# Altium project cs301_11.PrjPCB
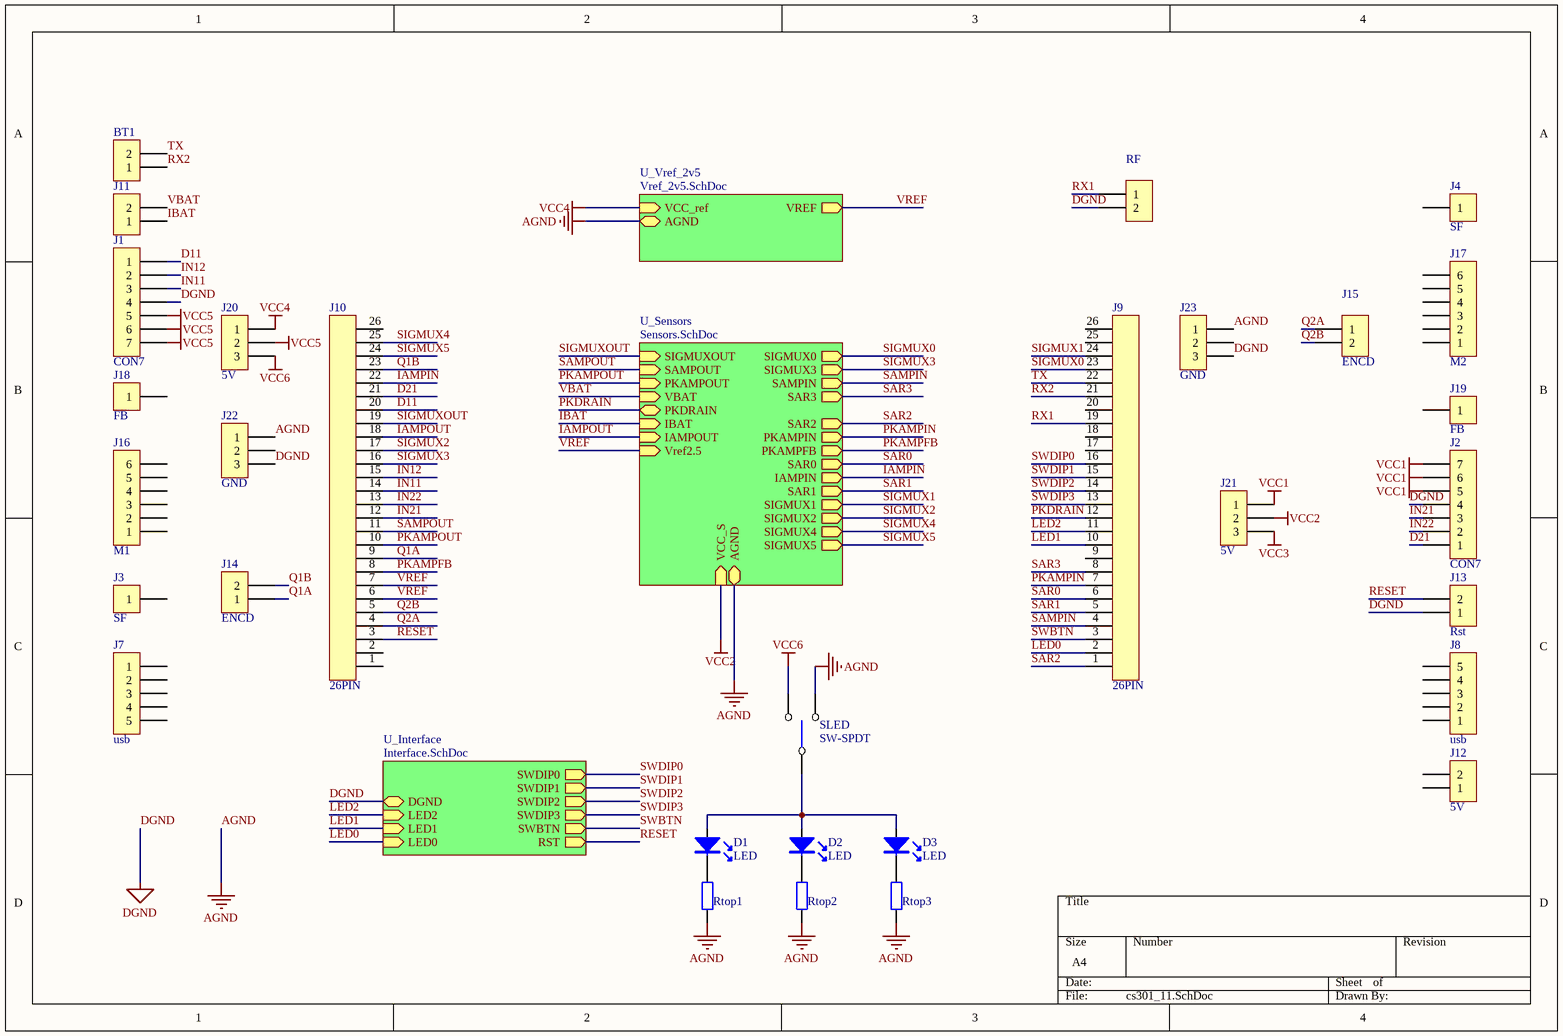
[diagram p0: cs301_11.SchDoc]
6 sheets, 112 parts. Net scope: hierarchical (ports join the sheet entries above them; power ports are global).
Board file: cs301_11.PcbDoc
Sheets:
  cs301_11.SchDoc
    U_Sensors = Sensors.SchDoc
      U_PT_Sensor1 = PT_Sensor.SchDoc
      U_PT_Sensor2 = PT_Sensor.SchDoc
      U_PT_Sensor3 = PT_Sensor.SchDoc
      U_PT_Sensor4 = PT_Sensor.SchDoc
      U_PT_Sensor5 = PT_Sensor.SchDoc
      U_PT_Sensor6 = PT_Sensor.SchDoc
      U_PT_Buffer1 = PT_Buffer.SchDoc
      U_PT_Buffer2 = PT_Buffer.SchDoc
      U_PT_Buffer3 = PT_Buffer.SchDoc
    U_Vref_2v5 = Vref_2v5.SchDoc
    U_Interface = Interface.SchDoc

## Sheet cs301_11.SchDoc
size A4

### Parts
BT1  Battery  [sip2]  (value not drawn)
D1  LED  [LED0.1/5MM]
D2  LED  [LED0.1/5MM]
D3  LED  [LED0.1/5MM]
J1  CON7  [SIP7]
J2  CON7  [SIP7]
J3  SF  [SIP1/0.6]
J4  SF  [SIP1/0.6]
J7  usb  [SIP5]
J8  usb  [SIP5]
J9  26PIN  [SIP26]
J10  26PIN  [SIP26]
J11  Battery  [sip2]  (value not drawn)
J12  5V  [sip2]
J13  Rst  [sip2]
J14  ENCD  [sip2]
J15  ENCD  [sip2]
J16  M1  [sip6]
J17  M2  [sip6]
J18  FB  [SIP1/0.6]
J19  FB  [SIP1/0.6]
J20  5V  [sip3]
J21  5V  [sip3]
J22  GND  [sip3]
J23  GND  [sip3]
RF  (no value)  [sip2]
Rtop1  270R  [ECE-RESC1608-0603SM]  (value not drawn)
Rtop2  270R  [ECE-RESC1608-0603SM]  (value not drawn)
Rtop3  270R  [ECE-RESC2012-0805SM]  (value not drawn)
SLED  SW-SPDT  [SW-SPDT]

### Sub-sheets
U_Interface = Interface.SchDoc: SWDIP0 (out), SWDIP1 (out), SWDIP2 (out), SWDIP3 (out), SWBTN (out), DGND (bidir), LED2 (in), LED1 (in), LED0 (in), RST (out)
U_Sensors = Sensors.SchDoc: SIGMUX0 (out), SIGMUX3 (out), SIGMUXOUT (in), SAMPIN (out), SAR3 (out), Vref2.5 (in), SAMPOUT (in), SAR2 (out), PKAMPIN (out), PKAMPOUT (in), PKAMPFB (out), VBAT (in), SAR0 (out), PKDRAIN (bidir), IBAT (in), IAMPIN (out), IAMPOUT (in), SAR1 (out), SIGMUX1 (out), SIGMUX2 (out), SIGMUX4 (out), SIGMUX5 (out), VCC_S (in), AGND (bidir)
U_Vref_2v5 = Vref_2v5.SchDoc: VREF (out), VCC_ref (in), AGND (bidir)

### Nets
AGND: J22.1 J23.1 Rtop1.1 Rtop2.1 Rtop3.1 SLED.3 ; sheet U_Sensors/AGND, sheet U_Vref_2v5/AGND
DGND: J1.4 J2.4 J13.1 J22.3 J23.3 RF.2 ; sheet U_Interface/DGND
VCC1: J2.5 J2.6 J2.7 J21.1
VCC2: J21.2 ; sheet U_Sensors/VCC_S
VCC3: J21.3
VCC4: J20.1 ; sheet U_Vref_2v5/VCC_ref
VCC5: J1.5 J1.6 J1.7 J20.2
VCC6: J20.3 SLED.1
D11: J1.1 J10.20
D21: J2.1 J10.21
IAMPIN: J10.22 J11.1 ; sheet U_Sensors/IBAT, sheet U_Sensors/IAMPIN  [also labelled IBAT]
IAMPOUT: J9.5 J10.18 ; sheet U_Sensors/IAMPOUT, sheet U_Sensors/SAR1  [also labelled SAR1]
IN11: J1.3 J10.14
IN12: J1.2 J10.15
IN21: J2.3 J10.12
IN22: J2.2 J10.13
LED0: J9.2 ; sheet U_Interface/LED0
LED1: J9.10 ; sheet U_Interface/LED1
LED2: J9.11 ; sheet U_Interface/LED2
PKAMPFB: J10.8 ; sheet U_Sensors/PKAMPFB
PKAMPIN: J9.1 J9.7 J10.11 ; sheet U_Sensors/SAMPOUT, sheet U_Sensors/SAR2, sheet U_Sensors/PKAMPIN  [also labelled SAMPOUT, SAR2]
PKAMPOUT: J10.10 ; sheet U_Sensors/PKAMPOUT
PKDRAIN: J9.12 ; sheet U_Sensors/PKDRAIN
Q1A: J10.9 J14.1
Q1B: J10.23 J14.2
Q2A: J10.4 J15.1
Q2B: J10.5 J15.2
RESET: J10.3 J13.2 ; sheet U_Interface/RST
RX1: J9.19 RF.1
RX2: BT1.1 J9.21
SAMPIN: J9.4 ; sheet U_Sensors/SAMPIN
SAR0: J9.6 ; sheet U_Sensors/SAR0
SAR3: J9.8 J10.19 ; sheet U_Sensors/SIGMUXOUT, sheet U_Sensors/SAR3  [also labelled SIGMUXOUT]
SIGMUX0: J9.23 ; sheet U_Sensors/SIGMUX0
SIGMUX1: J9.24 ; sheet U_Sensors/SIGMUX1
SIGMUX2: J10.17 ; sheet U_Sensors/SIGMUX2
SIGMUX3: J10.16 ; sheet U_Sensors/SIGMUX3
SIGMUX4: J10.25 ; sheet U_Sensors/SIGMUX4
SIGMUX5: J10.24 ; sheet U_Sensors/SIGMUX5
SWBTN: J9.3 ; sheet U_Interface/SWBTN
SWDIP0: J9.16 ; sheet U_Interface/SWDIP0
SWDIP1: J9.15 ; sheet U_Interface/SWDIP1
SWDIP2: J9.14 ; sheet U_Interface/SWDIP2
SWDIP3: J9.13 ; sheet U_Interface/SWDIP3
TX: BT1.2 J9.22
VBAT: J11.2 ; sheet U_Sensors/VBAT
VREF: J10.6 J10.7 ; sheet U_Sensors/Vref2.5, sheet U_Vref_2v5/VREF
NetD1_A: D1.A D2.A D3.A SLED.2
NetD1_K: D1.K Rtop1.2
NetD2_K: D2.K Rtop2.2
NetD3_K: D3.K Rtop3.2

Not connected (* = marked no-connect by the designer): J3 1; J4 1; J7 1 2 3 4 5; J8 1 2 3 4 5; J9 9 17 18 20 25 26; J10 1 2 26; J12 1 2; J16 1 2 3 4 5 6; J17 1 2 3 4 5 6; J18 1; J19 1; J22 2; J23 2

### Library data of the parts
BT1 J11-J15 RF = CON2: Connector
J1 J2 = CON7: Connector
J3 J4 J18 J19 = CON1: Connector
J7 J8 = CON5: Connector
J16 J17 = CON6: Connector
J20-J23 = CON3: Connector
Rtop1 Rtop2 = RES000131: RES CER 270R 1608 SM; Assembly Method: Surface Mount; Voltage/Current: 1/10W; Item Type: Item; Path: ece/ts/Lists/Stock Inventory; Value: 270R; UoA Stock#: RES000131; Size/Package: 1608 (0603); Component Type: RES-1608-270R; Category: Resistor; Status: Active
Rtop3 = RES000531: RES CER 270R 2012 SM; Assembly Method: Surface Mount; Voltage/Current: 1/8W; Item Type: Item; Path: ece/ts/Lists/Stock Inventory; Value: 270R; UoA Stock#: RES000531; Size/Package: 2012 (0805); Component Type: RES-2012-270R; Category: Resistor; Status: Active
SLED = SW-SPDT: Toggle Switch

## Sheet Sensors.SchDoc
size A4
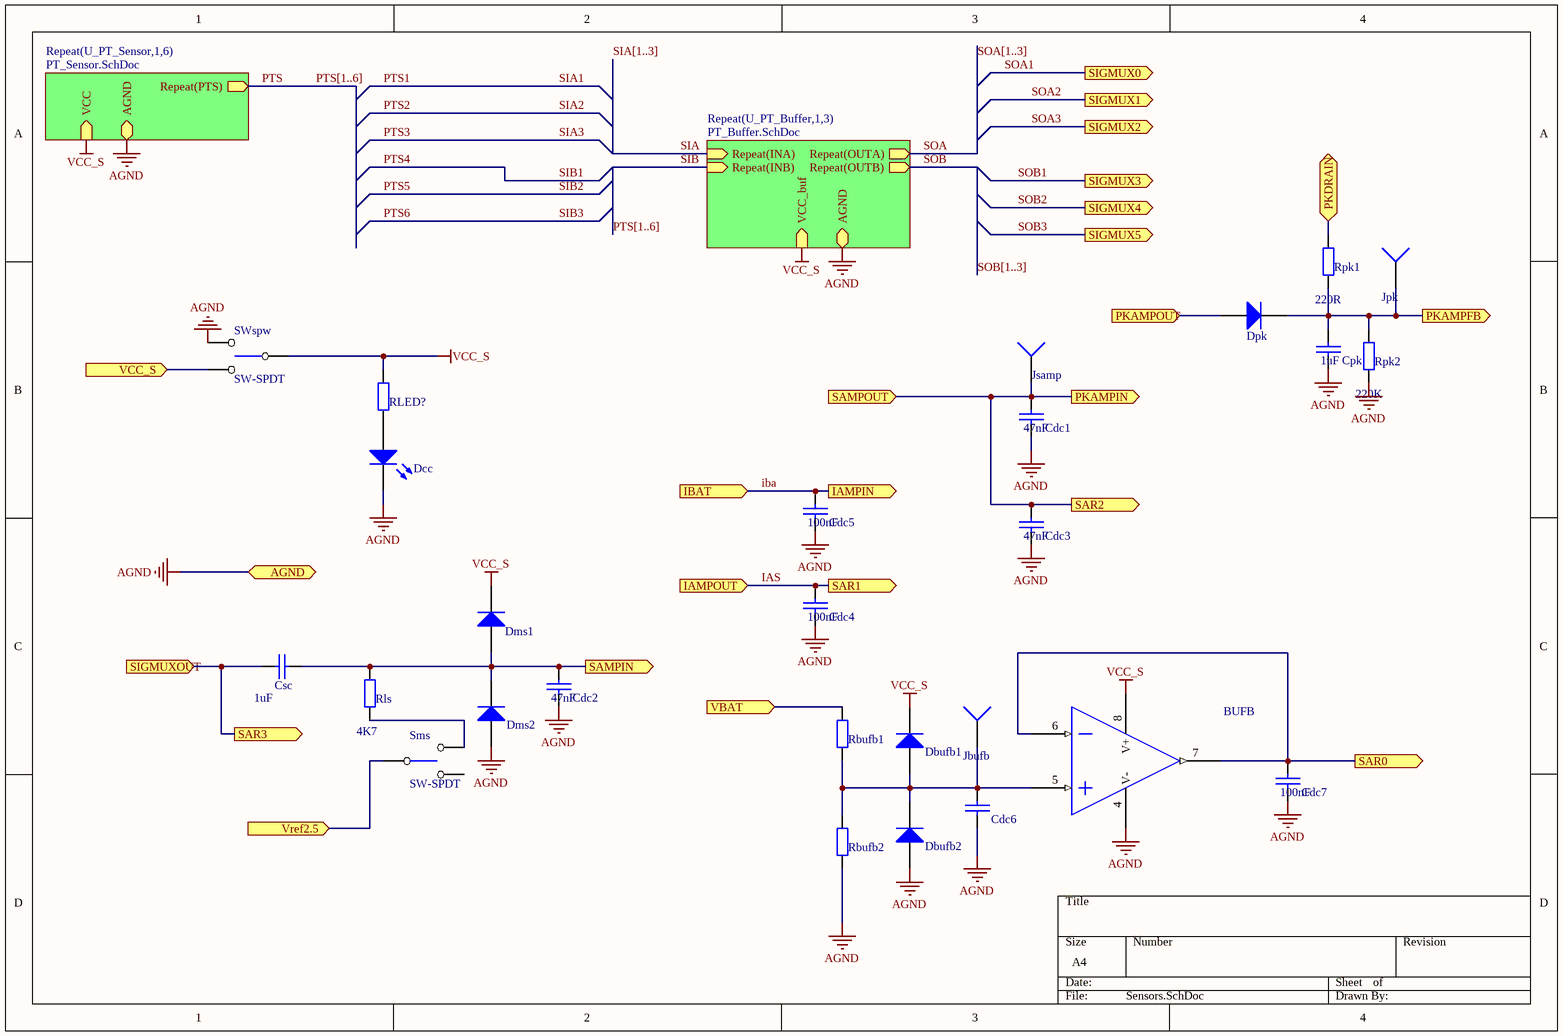
[diagram p1: Sensors.SchDoc]

### Parts
BUF  LT6221  [ECE-SO8]  (value not drawn)  (part B of 2)
Cdc1  47nF  [ECE-CAPC2012-0805SM]
Cdc2  47nF  [ECE-CAPC2012-0805SM]
Cdc3  47nF  [ECE-CAPC1608-0603SM]
Cdc4  100nF  [ECE-CAPC2012-0805SM]
Cdc5  100nF  [ECE-CAPC2012-0805SM]
Cdc6  100nF  [ECE-CAPC1608-0603SM]  (value not drawn)
Cdc7  100nF  [ECE-CAPC2012-0805SM]
Cpk  1uF  [ECE-CAPC1608-0603SM]
Csc  1uF  [ECE-CAPC2012-0805SM]
Dbufb1  1N4148  [ECE-DIO10.46-5.3x2.8TH]  (value not drawn)
Dbufb2  1N4148  [ECE-DIO10.46-5.3x2.8TH]  (value not drawn)
Dcc  LTST-C170KAKT  [ECE-LED2012-0805SM]  (value not drawn)
Dms1  1N4148  [ECE-DIO10.46-5.3x2.8TH]  (value not drawn)
Dms2  1N4148  [ECE-DIO10.46-5.3x2.8TH]  (value not drawn)
Dpk  1N4148  [ECE-DIO10.46-5.3x2.8TH]  (value not drawn)
Jbufb  TEST PIN  [ECE-HDR1TH]  (value not drawn)
Jpk  TEST PIN  [ECE-HDR1TH]  (value not drawn)
Jsamp  TEST PIN  [ECE-HDR1TH]  (value not drawn)
Rbufb1  47K  [ECE-RESC1608-0603SM]  (value not drawn)
Rbufb2  56K  [ECE-RESC2012-0805SM]  (value not drawn)
RLED?  270R  [ECE-RESC1608-0603SM]  (value not drawn)
Rls  4K7  [ECE-RESC2012-0805SM]
Rpk1  220R  [ECE-RESC1608-0603SM]
Rpk2  220K  [ECE-RESC1608-0603SM]
Sms  SW-SPDT  [SW-SPDT]
SWspw  SW-SPDT  [SW-SPDT]

### Sub-sheets
Repeat(U_PT_Buffer,1,3) = PT_Buffer.SchDoc: Repeat(INA) (in), Repeat(INB) (in), Repeat(OUTA) (out), Repeat(OUTB) (out), VCC_buf (in), AGND
Repeat(U_PT_Sensor,1,6) = PT_Sensor.SchDoc: Repeat(PTS) (out), VCC (in), AGND (bidir)

### Ports
AGND (bidir), IAMPIN (out), IAMPOUT (in), IBAT (in), PKAMPFB (out), PKAMPIN (out), PKAMPOUT (in), PKDRAIN (bidir), SAMPIN (out), SAMPOUT (in), SAR0 (out), SAR1 (out), SAR2 (out), SAR3 (out), SIGMUX0 (out), SIGMUX1 (out), SIGMUX2 (out), SIGMUX3 (out), SIGMUX4 (out), SIGMUX5 (out), SIGMUXOUT (in), VBAT (in), VCC_S (in), Vref2.5 (in)

### Nets
AGND: BUF.4(V-) Cdc1.2 Cdc2.2 Cdc3.2 Cdc4.2 Cdc5.2 Cdc6.2 Cdc7.2 Cpk.2 Dbufb2.1(A) Dcc.2(K) Dms2.1(A) Rbufb2.1 Rpk2.1 SWspw.3 ; port AGND, sheet Repeat(U_PT_Sensor,1,6)/AGND, sheet Repeat(U_PT_Buffer,1,3)/AGND
VCC2: SWspw.1 ; port VCC_S
VCC_S: BUF.8(V+) Dbufb1.2(K) Dms1.2(K) RLED?.2 SWspw.2 ; sheet Repeat(U_PT_Sensor,1,6)/VCC, sheet Repeat(U_PT_Buffer,1,3)/VCC_buf  [project net VCC]
IAS: Cdc4.1 ; port IAMPOUT, port SAR1  [project net IAMPOUT]
iba: Cdc5.1 ; port IBAT, port IAMPIN  [project net IAMPIN]
PKAMPFB: Cpk.1 Dpk.2(K) Jpk.1 Rpk1.1 Rpk2.2 ; port PKAMPFB
PKAMPIN: Cdc1.1 Cdc3.1 Jsamp.1 ; port SAMPOUT, port SAR2, port PKAMPIN
PKAMPOUT: Dpk.1(A) ; port PKAMPOUT
PKDRAIN: Rpk1.2 ; port PKDRAIN
PTS: sheet Repeat(U_PT_Sensor,1,6)/Repeat(PTS)
SAMPIN: Cdc2.1 Csc.2 Dms1.1(A) Dms2.2(K) Rls.2 ; port SAMPIN
SAR0: BUF.6(IN2(-)) BUF.7(OUT2) Cdc7.1 ; port SAR0
SAR3: Csc.1 ; port SIGMUXOUT, port SAR3
SIA: sheet Repeat(U_PT_Buffer,1,3)/Repeat(INA)
SIB: sheet Repeat(U_PT_Buffer,1,3)/Repeat(INB)
SOA: sheet Repeat(U_PT_Buffer,1,3)/Repeat(OUTA)
SOB: sheet Repeat(U_PT_Buffer,1,3)/Repeat(OUTB)
VBAT: Rbufb1.2 ; port VBAT
VREF: Sms.2 ; port Vref2.5
NetBUF_5: BUF.5(IN2(+)) Cdc6.1 Dbufb1.1(A) Dbufb2.2(K) Jbufb.1 Rbufb1.1 Rbufb2.2
NetDcc_1: Dcc.1(A) RLED?.1
NetRls_1: Rls.1 Sms.1

Not connected (* = marked no-connect by the designer): Sms 3

### Buses and harness runs
bus PTS[1..6]
bus SIA[1..3]
bus SOA[1..3]
bus SOB[1..3]

### Library data of the parts
BUF = OPA000102: IC OPAMP LT6221 DUAL SM; Manufactuer: Linear Technology; Manufacturer-PN: LT6221CS8#TRPBF; Assembly Method: Surface Mount; Item Type: Item; Path: ece/ts/Lists/Stock Inventory; UoA Stock#: OPA000102; Value: LT6221; Size/Package: S8; Datasheet Link: http://share.engineering.auckland.ac.nz/ece/ts/Student%20Documents/LT6221.pdf; Supplier1: Arrow; Supplier1-PN: LT6221CS8#TRPBF; Supplier2: Digikey; Supplier2-PN: LT6221CS8#PBF-ND; Component Type: S8-LT6221; Category: OpAmp; Status: Active
Cdc1 Cdc2 = CAP000522: CAP CER 47nF 50V X7R SM0805; Manufactuer: Samsung; Manufacturer-PN: CL21B473KBCNNNC; Assembly Method: Surface Mount; Item Type: Item; Path: ece/ts/Lists/Stock Inventory; Value: 47nF; UoA Stock#: CAP000522; Size/Package: 0805 (2012 Metric); Voltage/Current: 50V; Supplier1: Digikey; Supplier1-PN: 1276-1250-2-ND; Component Type: CAP-0805-47nF; Category: Capacitor; Status: Active
Cdc3 = CAP000622: CAP CER 47nF 50V X7R SM0603; Manufactuer: Samsung; Manufacturer-PN: CL10B473KB8NNNC; Assembly Method: Surface Mount; Item Type: Item; Path: ece/ts/Lists/Stock Inventory; Value: 47nF; UoA Stock#: CAP000622; Size/Package: 0603 (1608 Metric); Voltage/Current: 50V; Supplier1: Digikey; Supplier1-PN: 1276-1063-2-ND; Component Type: CAP-0603-47nF; Category: Capacitor; Status: Active
Cdc4 Cdc5 Cdc7 = CAP000524: CAP CER 100nF 50V X7R SM0805; Manufactuer: Samsung; Manufacturer-PN: CL21B104KBCNNNC; Assembly Method: Surface Mount; Item Type: Item; Path: ece/ts/Lists/Stock Inventory; Value: 100nF; UoA Stock#: CAP000524; Size/Package: 0805 (2012 Metric); Voltage/Current: 50V; Supplier1: Digikey; Supplier1-PN: 276-1003-2-ND; Component Type: CAP-0805-100nF; Category: Capacitor; Status: Active
Cdc6 = CAP000624: CAP CER 100nF 25V X7R SM0603; Manufactuer: Kemet; Manufacturer-PN: C0603C104K3RACTU; Assembly Method: Surface Mount; Item Type: Item; Path: ece/ts/Lists/Stock Inventory; Value: 100nF; UoA Stock#: CAP000624; Size/Package: 0603 (1608 Metric); Voltage/Current: 25V; Supplier1: Digikey; Supplier1-PN: 399-1281-2-ND; Component Type: CAP-0603-100nF; Category: Capacitor; Status: Active
Cpk = CAP000630: CAP CER 1uF 50V X7R SM0603; Manufactuer: Samsung; Manufacturer-PN: CL10B105KA8NNNC; Assembly Method: Surface Mount; Voltage/Current: 25V; Item Type: Item; Path: ece/ts/Lists/Stock Inventory; Value: 1uF; UoA Stock#: CAP000630; Size/Package: 0603 (1608 Metric); Supplier1: Digikey; Supplier1-PN: 1276-1184-2-ND; Component Type: CAP-0603-1uF; Category: Capacitor; Status: Active
Csc = CAP000530: CAP CER 1uF 50V X7R SM0805; Manufactuer: Samsung; Manufacturer-PN: CL21B105KBFNNNE; Assembly Method: Surface Mount; Item Type: Item; Path: ece/ts/Lists/Stock Inventory; Value: 1uF; UoA Stock#: CAP000530; Size/Package: 0805 (2012 Metric); Voltage/Current: 50V; Supplier1: Digikey; Supplier1-PN: 1276-1029-2-ND; Component Type: CAP-0805-1uF; Category: Capacitor; Status: Active
Dbufb1 Dbufb2 Dms1 Dms2 Dpk = DIO000005: Small Signal Diode 2A 100V TH; Manufactuer: VISHAY SEMICONDUCTOR; Assembly Method: Through hole; Voltage/Current: 2A-100V; Item Type: Item; Path: ece/ts/Lists/Stock Inventory; Value: 1N4148; UoA Stock#: DIO000005; Size/Package: Axial; Manufacturer-PN: 1N4148; Datasheet Link: http://share.engineering.auckland.ac.nz/ece/ts/Student%20Documents/1N4148_diode.pdf; Supplier1: Element14; Supplier1-PN: 1612346; Category: Diode; Status: Active
Dcc = DIO000105: LED RED ORANGE CLEAR 0805 SMD; Manufactuer: Lite-On Inc; Assembly Method: Surface Mount; Voltage/Current: 20mA; Item Type: Item; Path: ece/ts/Lists/Stock Inventory; UoA Stock#: DIO000105; Value: LTST-C170KAKT; Size/Package: 0805 (2012 Metric); Manufacturer-PN: LTST-C170KAKT; Datasheet Link: http://share.engineering.auckland.ac.nz/ece/ts/Student%20Documents/LED-S_110_LTST-C170KAKT.pdf; Supplier1: Digikey; Supplier1-PN: 160-1412-6-ND; Component Type: LED-0805-RED; Category: Diode; Status: Active
Jbufb Jpk Jsamp = CON000017: Value: 1 way; Assembly Method: Through hole; Item Type: Item; Path: ece/ts/Lists/Stock Inventory; UoA Stock#: CON000017; Component Type: NA; Category: Connector; Status: Active
Rbufb1 = RES000158: RES CER 47K 1608 SM; Manufactuer: Yageo; Manufacturer-PN: RC0603FR-0747KL; Assembly Method: Surface Mount; Voltage/Current: 1/10W; Item Type: Item; Path: ece/ts/Lists/Stock Inventory; Value: 47K; UoA Stock#: RES000158; Size/Package: 1608 (0603); Supplier1: Digikey; Supplier1-PN: 311-47.0KHRTR-ND; Component Type: RES-1608-47K; Category: Resistor; Status: Active; Datasheet Link: http://share.engineering.auckland.ac.nz/ece/ts/Student%20Documents/Yageo-Resistors.pdf
Rbufb2 = RES000559: RES CER 56K 2012 SM; Assembly Method: Surface Mount; Voltage/Current: 1/8W; Item Type: Item; Path: ece/ts/Lists/Stock Inventory; Value: 56K; UoA Stock#: RES000559; Size/Package: 2012 (0805); Component Type: RES-2012-56K; Category: Resistor; Status: Active
RLED? = RES000131: as Rtop1 on sheet cs301_11; Value: 270R; UoA Stock#: RES000131; Size/Package: 1608 (0603); Component Type: RES-1608-270R; Category: Resistor; Status: Active
Rls = RES000546: RES CER 4K7 2012 SM; Assembly Method: Surface Mount; Voltage/Current: 1/8W; Item Type: Item; Path: ece/ts/Lists/Stock Inventory; Value: 4K7; UoA Stock#: RES000546; Size/Package: 2012 (0805); Component Type: RES-2012-4K7; Category: Resistor; Status: Active
Rpk1 = RES000130: RES CER 220R 1608 SM; Manufactuer: Samsung; Manufacturer-PN: RC1608F221CS; Assembly Method: Surface Mount; Voltage/Current: 1/10W; Item Type: Item; Path: ece/ts/Lists/Stock Inventory; Value: 220R; UoA Stock#: RES000130; Size/Package: 1608 (0603); Supplier1: Digikey; Supplier1-PN: 1276-3496-2-ND; Component Type: RES-1608-220R; Category: Resistor; Status: Active; Datasheet Link: http://share.engineering.auckland.ac.nz/ece/ts/Student%20Documents/Samsung-CHIP_RESISTOR_150112_1.pdf
Rpk2 = RES000166: RES CER 220K 1608 SM; Manufactuer: Yageo; Manufacturer-PN: RC0603FR-07220KL; Assembly Method: Surface Mount; Voltage/Current: 1/10W; Item Type: Item; Path: ece/ts/Lists/Stock Inventory; Value: 220K; UoA Stock#: RES000166; Size/Package: 1608 (0603); Supplier1: Digikey; Supplier1-PN: 311-220KHRTR-ND; Component Type: RES-1608-220K; Category: Resistor; Status: Active; Datasheet Link: http://share.engineering.auckland.ac.nz/ece/ts/Student%20Documents/Yageo-Resistors.pdf
Sms SWspw = SW-SPDT: Toggle Switch

## Sheet PT_Sensor.SchDoc
size A4
Used 6 times, as channels U_Sensors/U_PT_Sensor1, U_Sensors/U_PT_Sensor2, U_Sensors/U_PT_Sensor3, U_Sensors/U_PT_Sensor4, U_Sensors/U_PT_Sensor5, U_Sensors/U_PT_Sensor6. Parts and nets are listed once, with the designators drawn on the sheet.
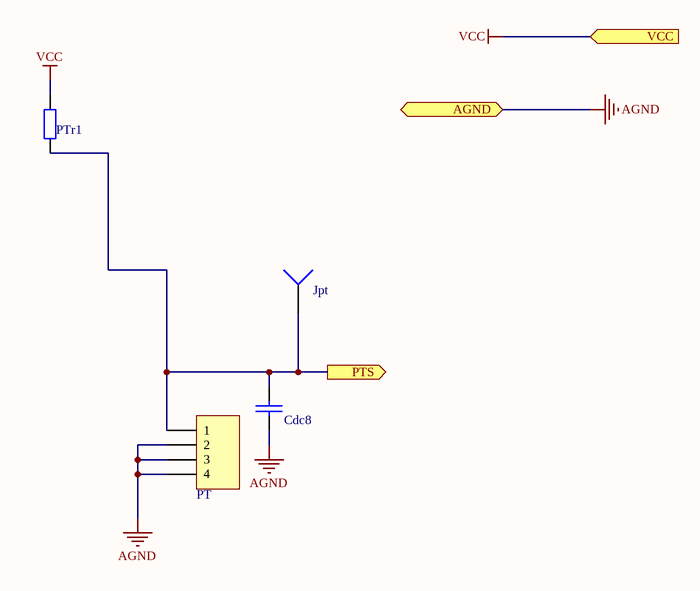
[diagram p2: PT_Sensor.SchDoc]

### Parts
Cdc8  47nF  [ECE-CAPC2012-0805SM]  (value not drawn)
Jpt  TEST PIN  [ECE-HDR1TH]  (value not drawn)
PT  4 Way  [ECE-600104STTH]  (value not drawn)
PTr1  39K  [ECE-RESC1608-0603SM]  (value not drawn)

### Ports
AGND (bidir), PTS (out), VCC (in)

### Nets
AGND: Cdc8.2 PT.2 PT.3 PT.4 ; port AGND
VCC: PTr1.2 ; port VCC
PTS: Cdc8.1 Jpt.1 PT.1 PTr1.1 ; port PTS

### Channels
U_Sensors/U_PT_Sensor1: designators end in _U_PT_Sensor1; ports AGND=AGND PTS=PTS1 VCC=VCC
U_Sensors/U_PT_Sensor2: designators end in _U_PT_Sensor2; ports AGND=AGND PTS=PTS2 VCC=VCC
U_Sensors/U_PT_Sensor3: designators end in _U_PT_Sensor3; ports AGND=AGND PTS=PTS3 VCC=VCC
U_Sensors/U_PT_Sensor4: designators end in _U_PT_Sensor4; ports AGND=AGND PTS=PTS4 VCC=VCC
U_Sensors/U_PT_Sensor5: designators end in _U_PT_Sensor5; ports AGND=AGND PTS=PTS5 VCC=VCC
U_Sensors/U_PT_Sensor6: designators end in _U_PT_Sensor6; ports AGND=AGND PTS=PTS6 VCC=VCC

### Library data of the parts
Cdc8 = CAP000522: as Cdc1 on sheet Sensors; Value: 47nF; UoA Stock#: CAP000522; Size/Package: 0805 (2012 Metric); Voltage/Current: 50V; Supplier1: Digikey; Supplier1-PN: 1276-1250-2-ND; Component Type: CAP-0805-47nF; Category: Capacitor; Status: Active
Jpt = CON000017: as Jbufb on sheet Sensors; UoA Stock#: CON000017; Component Type: NA; Category: Connector; Status: Active
PT = CON000003: HEADER POLARISED 4WAY TH; Manufactuer: GTK; Manufacturer-PN: 600104ST; Assembly Method: Through hole; Item Type: Item; Path: ece/ts/Lists/Stock Inventory; UoA Stock#: CON000003; Value: 4 Way; Size/Package: 2.54 Radial; Datasheet Link: http://share.engineering.auckland.ac.nz/ece/ts/Student%20Documents/polarised_connectors.pdf; Supplier1: Elecon; Supplier1-PN: YY3N04; Supplier2: Active Components; Supplier2-PN: 600104ST; Component Type: NA; Category: Connector; Status: Active
PTr1 = RES000157: RES CER 39K 1608 SM; Manufactuer: Yageo; Manufacturer-PN: RC0603FR-0739KL; Assembly Method: Surface Mount; Voltage/Current: 1/10W; Item Type: Item; Path: ece/ts/Lists/Stock Inventory; Value: 39K; UoA Stock#: RES000157; Size/Package: 1608 (0603); Supplier1: Digikey; Supplier1-PN: 311-39.0KHRTR-ND; Component Type: RES-1608-39K; Category: Resistor; Status: Active; Datasheet Link: http://share.engineering.auckland.ac.nz/ece/ts/Student%20Documents/Yageo-Resistors.pdf

## Sheet PT_Buffer.SchDoc
size A4
Used 3 times, as channels U_Sensors/U_PT_Buffer1, U_Sensors/U_PT_Buffer2, U_Sensors/U_PT_Buffer3. Parts and nets are listed once, with the designators drawn on the sheet.
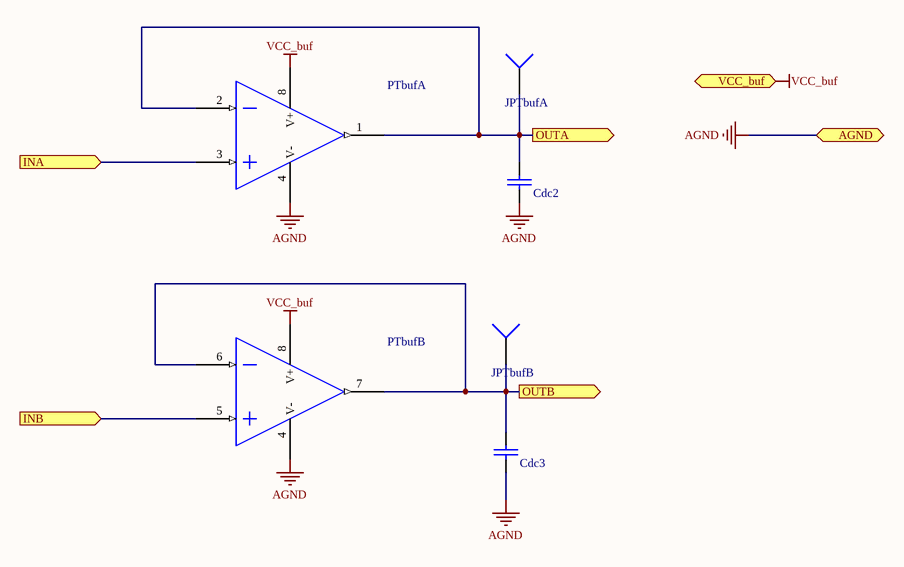
[diagram p3: PT_Buffer.SchDoc]

### Parts
Cdc2  47nF  [ECE-CAPC2012-0805SM]  (value not drawn)
Cdc3  47nF  [ECE-CAPC2012-0805SM]  (value not drawn)
JPTbufA  TEST PIN  [ECE-HDR1TH]  (value not drawn)
JPTbufB  TEST PIN  [ECE-HDR1TH]  (value not drawn)
PTbuf  LT6221  [ECE-SO8]  (value not drawn)  (parts A,B of 2)

### Ports
AGND, INA (in), INB (in), OUTA (out), OUTB (out), VCC_buf (in)

### Nets
AGND: Cdc2.2 Cdc3.2 PTbuf.4(V-) ; port AGND
VCC_buf: PTbuf.8(V+) ; port VCC_buf
INA: PTbuf.3(IN1(+)) ; port INA
INB: PTbuf.5(IN2(+)) ; port INB
OUTA: Cdc2.1 JPTbufA.1 PTbuf.1(OUT1) PTbuf.2(IN1(-)) ; port OUTA
OUTB: Cdc3.1 JPTbufB.1 PTbuf.6(IN2(-)) PTbuf.7(OUT2) ; port OUTB

### Channels
U_Sensors/U_PT_Buffer1: designators Cdc2=CDC2_U_PT_Buffer1 Cdc3=CDC3_U_PT_Buffer1 JPTbufA=JPTbufA_U_PT_Buffer1 JPTbufB=JPTbufB_U_PT_Buffer1 PTbuf=PTbuf_U_PT_Buffer1; ports AGND=AGND INA=PTS1 INB=PTS4 OUTA=SIGMUX0 OUTB=SIGMUX3 VCC_buf=VCC
U_Sensors/U_PT_Buffer2: designators Cdc2=CDC2_U_PT_Buffer2 Cdc3=CDC3_U_PT_Buffer2 JPTbufA=JPTbufA_U_PT_Buffer2 JPTbufB=JPTbufB_U_PT_Buffer2 PTbuf=PTbuf_U_PT_Buffer2; ports AGND=AGND INA=PTS2 INB=PTS5 OUTA=SIGMUX1 OUTB=SIGMUX4 VCC_buf=VCC
U_Sensors/U_PT_Buffer3: designators Cdc2=CDC2_U_PT_Buffer3 Cdc3=CDC3_U_PT_Buffer3 JPTbufA=JPTbufA_U_PT_Buffer3 JPTbufB=JPTbufB_U_PT_Buffer3 PTbuf=PTbuf_U_PT_Buffer3; ports AGND=AGND INA=PTS3 INB=PTS6 OUTA=SIGMUX2 OUTB=SIGMUX5 VCC_buf=VCC

### Library data of the parts
Cdc2 Cdc3 = CAP000522: as Cdc1 on sheet Sensors; Value: 47nF; UoA Stock#: CAP000522; Size/Package: 0805 (2012 Metric); Voltage/Current: 50V; Supplier1: Digikey; Supplier1-PN: 1276-1250-2-ND; Component Type: CAP-0805-47nF; Category: Capacitor; Status: Active
JPTbufA JPTbufB = CON000017: as Jbufb on sheet Sensors; UoA Stock#: CON000017; Component Type: NA; Category: Connector; Status: Active
PTbuf = OPA000102: as BUF on sheet Sensors; UoA Stock#: OPA000102; Value: LT6221; Size/Package: S8; Datasheet Link: http://share.engineering.auckland.ac.nz/ece/ts/Student%20Documents/LT6221.pdf; Supplier1: Arrow; Supplier1-PN: LT6221CS8#TRPBF; Supplier2: Digikey; Supplier2-PN: LT6221CS8#PBF-ND; Component Type: S8-LT6221; Category: OpAmp; Status: Active

## Sheet Vref_2v5.SchDoc
size A4
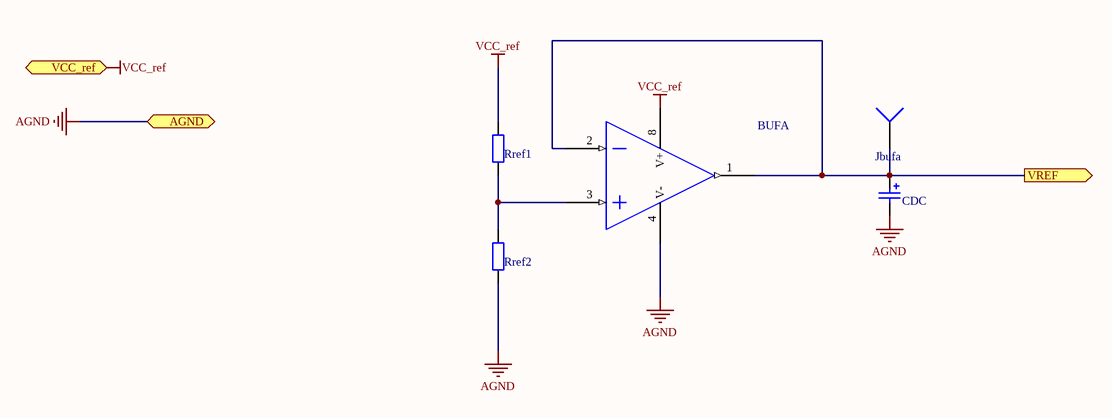
[diagram p4: Vref_2v5.SchDoc]

### Parts
BUF  LT6221  [ECE-SO8]  (value not drawn)  (part A of 2)
CDC  10uF  [ECE-CAPAE4X5.4SM]  (value not drawn)
Jbufa  TEST PIN  [ECE-HDR1TH]  (value not drawn)
Rref1  47K  [ECE-RESC1608-0603SM]  (value not drawn)
Rref2  47K  [ECE-RESC1608-0603SM]  (value not drawn)

### Ports
AGND (bidir), VCC_ref (in), VREF (out)

### Nets
AGND: BUF.4(V-) CDC.2 Rref2.1 ; port AGND
VCC_ref: BUF.8(V+) Rref1.2 ; port VCC_ref  [project net VCC4]
VREF: BUF.1(OUT1) BUF.2(IN1(-)) CDC.1 Jbufa.1 ; port VREF
NetBUF_3: BUF.3(IN1(+)) Rref1.1 Rref2.2

### Library data of the parts
BUF = OPA000102: as BUF on sheet Sensors; UoA Stock#: OPA000102; Value: LT6221; Size/Package: S8; Datasheet Link: http://share.engineering.auckland.ac.nz/ece/ts/Student%20Documents/LT6221.pdf; Supplier1: Arrow; Supplier1-PN: LT6221CS8#TRPBF; Supplier2: Digikey; Supplier2-PN: LT6221CS8#PBF-ND; Component Type: S8-LT6221; Category: OpAmp; Status: Active
CDC = CAP000303: CAP 10uF 16V ELE SM; Manufactuer: Nichicon; Manufacturer-PN: UWT1C100MCL1GB; Assembly Method: Surface Mount; Item Type: Item; Path: ece/ts/Lists/Stock Inventory; Revision: July-2002: Re-released for DXP Platform.; Value: 10uF; UoA Stock#: CAP000303; Size/Package: 4 X 5.4; Voltage/Current: 16V; Datasheet Link: http://share.engineering.auckland.ac.nz/ece/ts/Student%20Documents/SMT-Ecaps-e-wx.pdf; Supplier1: Digikey; Supplier1-PN: 493-2173-2-ND; Component Type: CAP-4X5.4-10uF-16V; Category: Capacitor; Status: Active
Jbufa = CON000017: as Jbufb on sheet Sensors; UoA Stock#: CON000017; Component Type: NA; Category: Connector; Status: Active
Rref1 Rref2 = RES000158: as Rbufb1 on sheet Sensors; Value: 47K; UoA Stock#: RES000158; Size/Package: 1608 (0603); Supplier1: Digikey; Supplier1-PN: 311-47.0KHRTR-ND; Component Type: RES-1608-47K; Category: Resistor; Status: Active; Datasheet Link: http://share.engineering.auckland.ac.nz/ece/ts/Student%20Documents/Yageo-Resistors.pdf

## Sheet Interface.SchDoc
size A4
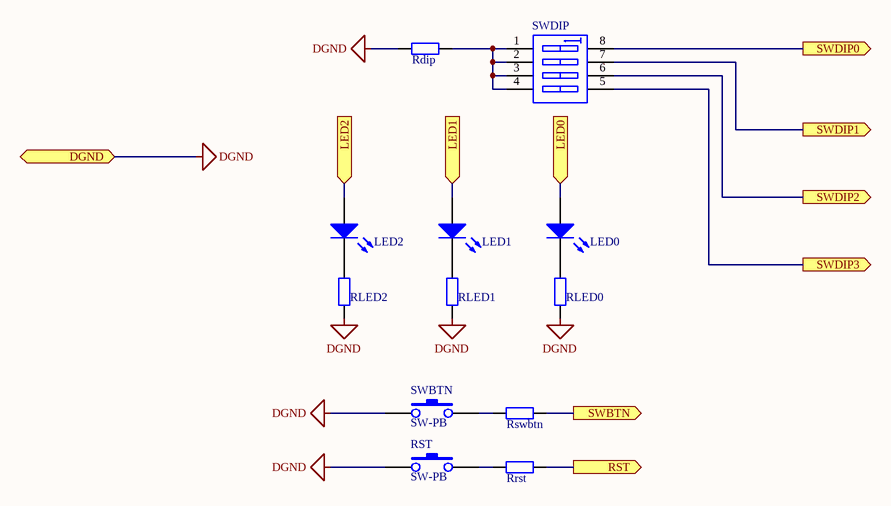
[diagram p5: Interface.SchDoc]

### Parts
LED0  LTST-C170KGKT  [ECE-LED2012-0805SM]  (value not drawn)
LED1  LTST-C170KAKT  [ECE-LED2012-0805SM]  (value not drawn)
LED2  LTST-C170KAKT  [ECE-LED2012-0805SM]  (value not drawn)
Rdip  1K  [ECE-RESC2012-0805SM]  (value not drawn)
RLED0  270R  [ECE-RESC1608-0603SM]  (value not drawn)
RLED1  270R  [ECE-RESC1608-0603SM]  (value not drawn)
RLED2  270R  [ECE-RESC1608-0603SM]  (value not drawn)
Rrst  1K  [ECE-RESC1608-0603SM]  (value not drawn)
RST  SW-PB  [SW-PB]
Rswbtn  1K  [ECE-RESC1608-0603SM]  (value not drawn)
SWBTN  SW-PB  [SW-PB]
SWDIP  *  [ECE-DIP8]  (value not drawn)

### Ports
DGND (bidir), LED0 (in), LED1 (in), LED2 (in), RST (out), SWBTN (out), SWDIP0 (out), SWDIP1 (out), SWDIP2 (out), SWDIP3 (out)

### Nets
DGND: Rdip.1 RLED0.1 RLED1.1 RLED2.1 RST.1 SWBTN.1 ; port DGND
LED0: LED0.1(A) ; port LED0
LED1: LED1.1(A) ; port LED1
LED2: LED2.1(A) ; port LED2
RESET: Rrst.2 ; port RST
SWBTN: Rswbtn.2 ; port SWBTN
SWDIP0: SWDIP.8(B1) ; port SWDIP0
SWDIP1: SWDIP.7(B2) ; port SWDIP1
SWDIP2: SWDIP.6(B3) ; port SWDIP2
SWDIP3: SWDIP.5(B4) ; port SWDIP3
NetLED0_2: LED0.2(K) RLED0.2
NetLED1_2: LED1.2(K) RLED1.2
NetLED2_2: LED2.2(K) RLED2.2
NetRdip_2: Rdip.2 SWDIP.1(A1) SWDIP.2(A2) SWDIP.3(A3) SWDIP.4(A4)
NetRrst_1: Rrst.1 RST.2
NetRswbtn_1: Rswbtn.1 SWBTN.2

### Library data of the parts
LED0 = DIO000104: LED GREEN CLEAR 0805 SM; Manufactuer: Lite-On Inc; Assembly Method: Surface Mount; Voltage/Current: 20mA; Item Type: Item; Path: ece/ts/Lists/Stock Inventory; UoA Stock#: DIO000104; Value: LTST-C170KGKT; Size/Package: 0805 (2012 Metric); Manufacturer-PN: LTST-C170KGKT; Datasheet Link: http://share.engineering.auckland.ac.nz/ece/ts/Student%20Documents/LED-S_110_LTST-C170KGKT.pdf; Supplier1: Digikey; Supplier1-PN: 160-1414-6-ND; Component Type: LED-0805-GREEN; Category: Diode; Status: Active
LED1 LED2 = DIO000105: as Dcc on sheet Sensors; UoA Stock#: DIO000105; Value: LTST-C170KAKT; Size/Package: 0805 (2012 Metric); Manufacturer-PN: LTST-C170KAKT; Datasheet Link: http://share.engineering.auckland.ac.nz/ece/ts/Student%20Documents/LED-S_110_LTST-C170KAKT.pdf; Supplier1: Digikey; Supplier1-PN: 160-1412-6-ND; Component Type: LED-0805-RED; Category: Diode; Status: Active
Rdip = RES000538: RES CER 1K 2012 SM; Manufactuer: Yageo; Manufacturer-PN: RC0805FR-071KL; Assembly Method: Surface Mount; Voltage/Current: 1/8W; Item Type: Item; Path: ece/ts/Lists/Stock Inventory; Value: 1K; UoA Stock#: RES000538; Size/Package: 2012 (0805); Supplier1: Digikey; Supplier1-PN: 311-1.00KCRTR-ND; Component Type: RES-2012-1K; Category: Resistor; Status: Active; Datasheet Link: http://share.engineering.auckland.ac.nz/ece/ts/Student%20Documents/Yageo-Resistors.pdf
RLED0-RLED2 = RES000131: as Rtop1 on sheet cs301_11; Value: 270R; UoA Stock#: RES000131; Size/Package: 1608 (0603); Component Type: RES-1608-270R; Category: Resistor; Status: Active
Rrst Rswbtn = RES000138: RES CER 1K 1608 SM; Manufactuer: Panasonic; Manufacturer-PN: ERJ-3EKF1001V; Assembly Method: Surface Mount; Voltage/Current: 1/10W; Item Type: Item; Path: ece/ts/Lists/Stock Inventory; Value: 1K; UoA Stock#: RES000138; Size/Package: 1608 (0603); Supplier1: Digikey; Supplier1-PN: P1.00KHTR-ND; Component Type: RES-1608-1K; Category: Resistor; Status: Active; Datasheet Link: http://share.engineering.auckland.ac.nz/ece/ts/Student%20Documents/Panasonic-Resistors.pdf
RST SWBTN = SW-PB: Push Button Switch
SWDIP = Switch-DIP8: Value: *

## Nets that join several sheets
AGND: cs301_11 (6 pins), Sensors (15 pins), U_Sensors/U_PT_Sensor1 (Cdc8_U_PT_Sensor1.2 PT_U_PT_Sensor1.2 PT_U_PT_Sensor1.3 PT_U_PT_Sensor1.4), U_Sensors/U_PT_Sensor2 (Cdc8_U_PT_Sensor2.2 PT_U_PT_Sensor2.2 PT_U_PT_Sensor2.3 PT_U_PT_Sensor2.4), U_Sensors/U_PT_Sensor3 (Cdc8_U_PT_Sensor3.2 PT_U_PT_Sensor3.2 PT_U_PT_Sensor3.3 PT_U_PT_Sensor3.4), U_Sensors/U_PT_Sensor4 (Cdc8_U_PT_Sensor4.2 PT_U_PT_Sensor4.2 PT_U_PT_Sensor4.3 PT_U_PT_Sensor4.4), U_Sensors/U_PT_Sensor5 (Cdc8_U_PT_Sensor5.2 PT_U_PT_Sensor5.2 PT_U_PT_Sensor5.3 PT_U_PT_Sensor5.4), U_Sensors/U_PT_Sensor6 (Cdc8_U_PT_Sensor6.2 PT_U_PT_Sensor6.2 PT_U_PT_Sensor6.3 PT_U_PT_Sensor6.4), U_Sensors/U_PT_Buffer1 (CDC2_U_PT_Buffer1.2 CDC3_U_PT_Buffer1.2 PTbuf_U_PT_Buffer1.4), U_Sensors/U_PT_Buffer2 (CDC2_U_PT_Buffer2.2 CDC3_U_PT_Buffer2.2 PTbuf_U_PT_Buffer2.4), U_Sensors/U_PT_Buffer3 (CDC2_U_PT_Buffer3.2 CDC3_U_PT_Buffer3.2 PTbuf_U_PT_Buffer3.4), Vref_2v5 (BUF.4 CDC.2 Rref2.1)
DGND: cs301_11 (6 pins), Interface (6 pins)
VCC: Sensors (5 pins), U_Sensors/U_PT_Sensor1 (PTr1_U_PT_Sensor1.2), U_Sensors/U_PT_Sensor2 (PTr1_U_PT_Sensor2.2), U_Sensors/U_PT_Sensor3 (PTr1_U_PT_Sensor3.2), U_Sensors/U_PT_Sensor4 (PTr1_U_PT_Sensor4.2), U_Sensors/U_PT_Sensor5 (PTr1_U_PT_Sensor5.2), U_Sensors/U_PT_Sensor6 (PTr1_U_PT_Sensor6.2), U_Sensors/U_PT_Buffer1 (PTbuf_U_PT_Buffer1.8), U_Sensors/U_PT_Buffer2 (PTbuf_U_PT_Buffer2.8), U_Sensors/U_PT_Buffer3 (PTbuf_U_PT_Buffer3.8)
VCC2: cs301_11 (J21.2), Sensors (SWspw.1)
VCC4: cs301_11 (J20.1), Vref_2v5 (BUF.8 Rref1.2)
IAMPIN: cs301_11 (J10.22 J11.1), Sensors (Cdc5.1)
IAMPOUT: cs301_11 (J9.5 J10.18), Sensors (Cdc4.1)
LED0: cs301_11 (J9.2), Interface (LED0.1)
LED1: cs301_11 (J9.10), Interface (LED1.1)
LED2: cs301_11 (J9.11), Interface (LED2.1)
PKAMPFB: cs301_11 (J10.8), Sensors (5 pins)
PKAMPIN: cs301_11 (J9.1 J9.7 J10.11), Sensors (Cdc1.1 Cdc3.1 Jsamp.1)
PKAMPOUT: cs301_11 (J10.10), Sensors (Dpk.1)
PKDRAIN: cs301_11 (J9.12), Sensors (Rpk1.2)
PTS1: U_Sensors/U_PT_Sensor1 (Cdc8_U_PT_Sensor1.1 Jpt_U_PT_Sensor1.1 PT_U_PT_Sensor1.1 PTr1_U_PT_Sensor1.1), U_Sensors/U_PT_Buffer1 (PTbuf_U_PT_Buffer1.3)
PTS2: U_Sensors/U_PT_Sensor2 (Cdc8_U_PT_Sensor2.1 Jpt_U_PT_Sensor2.1 PT_U_PT_Sensor2.1 PTr1_U_PT_Sensor2.1), U_Sensors/U_PT_Buffer2 (PTbuf_U_PT_Buffer2.3)
PTS3: U_Sensors/U_PT_Sensor3 (Cdc8_U_PT_Sensor3.1 Jpt_U_PT_Sensor3.1 PT_U_PT_Sensor3.1 PTr1_U_PT_Sensor3.1), U_Sensors/U_PT_Buffer3 (PTbuf_U_PT_Buffer3.3)
PTS4: U_Sensors/U_PT_Sensor4 (Cdc8_U_PT_Sensor4.1 Jpt_U_PT_Sensor4.1 PT_U_PT_Sensor4.1 PTr1_U_PT_Sensor4.1), U_Sensors/U_PT_Buffer1 (PTbuf_U_PT_Buffer1.5)
PTS5: U_Sensors/U_PT_Sensor5 (Cdc8_U_PT_Sensor5.1 Jpt_U_PT_Sensor5.1 PT_U_PT_Sensor5.1 PTr1_U_PT_Sensor5.1), U_Sensors/U_PT_Buffer2 (PTbuf_U_PT_Buffer2.5)
PTS6: U_Sensors/U_PT_Sensor6 (Cdc8_U_PT_Sensor6.1 Jpt_U_PT_Sensor6.1 PT_U_PT_Sensor6.1 PTr1_U_PT_Sensor6.1), U_Sensors/U_PT_Buffer3 (PTbuf_U_PT_Buffer3.5)
RESET: cs301_11 (J10.3 J13.2), Interface (Rrst.2)
SAMPIN: cs301_11 (J9.4), Sensors (5 pins)
SAR0: cs301_11 (J9.6), Sensors (BUF.6 BUF.7 Cdc7.1)
SAR3: cs301_11 (J9.8 J10.19), Sensors (Csc.1)
SIGMUX0: cs301_11 (J9.23), U_Sensors/U_PT_Buffer1 (CDC2_U_PT_Buffer1.1 JPTbufA_U_PT_Buffer1.1 PTbuf_U_PT_Buffer1.1 PTbuf_U_PT_Buffer1.2)
SIGMUX1: cs301_11 (J9.24), U_Sensors/U_PT_Buffer2 (CDC2_U_PT_Buffer2.1 JPTbufA_U_PT_Buffer2.1 PTbuf_U_PT_Buffer2.1 PTbuf_U_PT_Buffer2.2)
SIGMUX2: cs301_11 (J10.17), U_Sensors/U_PT_Buffer3 (CDC2_U_PT_Buffer3.1 JPTbufA_U_PT_Buffer3.1 PTbuf_U_PT_Buffer3.1 PTbuf_U_PT_Buffer3.2)
SIGMUX3: cs301_11 (J10.16), U_Sensors/U_PT_Buffer1 (CDC3_U_PT_Buffer1.1 JPTbufB_U_PT_Buffer1.1 PTbuf_U_PT_Buffer1.6 PTbuf_U_PT_Buffer1.7)
SIGMUX4: cs301_11 (J10.25), U_Sensors/U_PT_Buffer2 (CDC3_U_PT_Buffer2.1 JPTbufB_U_PT_Buffer2.1 PTbuf_U_PT_Buffer2.6 PTbuf_U_PT_Buffer2.7)
SIGMUX5: cs301_11 (J10.24), U_Sensors/U_PT_Buffer3 (CDC3_U_PT_Buffer3.1 JPTbufB_U_PT_Buffer3.1 PTbuf_U_PT_Buffer3.6 PTbuf_U_PT_Buffer3.7)
SWBTN: cs301_11 (J9.3), Interface (Rswbtn.2)
SWDIP0: cs301_11 (J9.16), Interface (SWDIP.8)
SWDIP1: cs301_11 (J9.15), Interface (SWDIP.7)
SWDIP2: cs301_11 (J9.14), Interface (SWDIP.6)
SWDIP3: cs301_11 (J9.13), Interface (SWDIP.5)
VBAT: cs301_11 (J11.2), Sensors (Rbufb1.2)
VREF: cs301_11 (J10.6 J10.7), Sensors (Sms.2), Vref_2v5 (BUF.1 BUF.2 CDC.1 Jbufa.1)